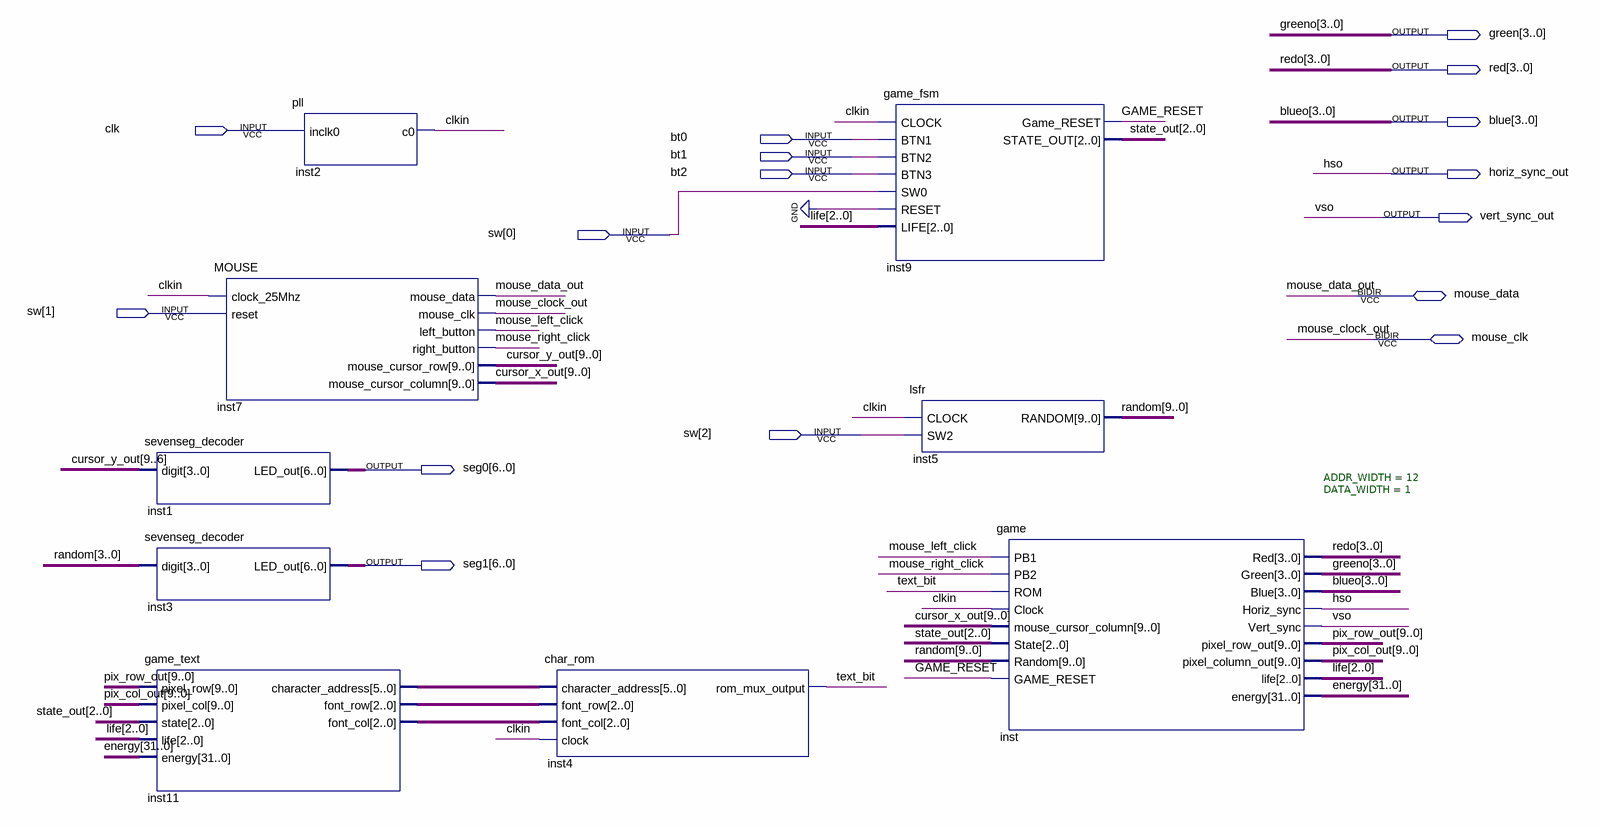
[diagram p0: schematic sheet]
// Quartus schematic miniproject.bdf as structural Verilog: 9 symbols, 16 pins
module miniproject (
  input  clk,
  input  bt0,
  input  bt1,
  input  bt2,
  input  [2:0] sw,
  inout  mouse_data,
  inout  mouse_clk,
  output [3:0] green,
  output [3:0] red,
  output [3:0] blue,
  output horiz_sync_out,
  output vert_sync_out,
  output [6:0] seg0,
  output [6:0] seg1
);

  wire clkin, GAME_RESET, mouse_left_click, mouse_right_click, text_bit;
  wire [2:0] inst11_font_col, inst11_font_row, life, state_out;
  wire [5:0] inst11_character_address;
  wire [9:0] cursor_x_out, cursor_y_out, pix_col_out, pix_row_out, random;
  wire [31:0] energy;

  sevenseg_decoder inst1 (.digit(cursor_y_out[9:6]), .LED_out(seg0));
  sevenseg_decoder inst3 (.digit(random[3:0]), .LED_out(seg1));
  game_text inst11 (
    .pixel_row(pix_row_out), .pixel_col(pix_col_out), .state(state_out), .life(life), .energy(energy),
    .character_address(inst11_character_address), .font_row(inst11_font_row), .font_col(inst11_font_col));
  MOUSE inst7 (
    .clock_25Mhz(clkin), .reset(sw[1]), .left_button(mouse_left_click), .right_button(mouse_right_click),
    .mouse_cursor_row(cursor_y_out), .mouse_cursor_column(cursor_x_out), .mouse_data(mouse_data),
    .mouse_clk(mouse_clk));
  pll inst2 (.inclk0(clk), .c0(clkin));
  char_rom inst4 (
    .character_address(inst11_character_address), .font_row(inst11_font_row), .font_col(inst11_font_col),
    .clock(clkin), .rom_mux_output(text_bit));
  game_fsm inst9 (
    .CLOCK(clkin), .BTN1(bt0), .BTN2(bt1), .BTN3(bt2), .SW0(sw[0]), .RESET(1'b0), .LIFE(life),
    .Game_RESET(GAME_RESET), .STATE_OUT(state_out));
  lsfr inst5 (.CLOCK(clkin), .SW2(sw[2]), .RANDOM(random));
  game #(.ADDR_WIDTH(12), .DATA_WIDTH(1)) inst (
    .PB1(mouse_left_click), .PB2(mouse_right_click), .ROM(text_bit), .Clock(clkin),
    .mouse_cursor_column(cursor_x_out), .State(state_out), .Random(random), .GAME_RESET(GAME_RESET),
    .Red(red), .Green(green), .Blue(blue), .Horiz_sync(horiz_sync_out), .Vert_sync(vert_sync_out),
    .pixel_row_out(pix_row_out), .pixel_column_out(pix_col_out), .life(life), .energy(energy));

  // Other names for the same wires on the sheet: blueo[3:0] = blue; greeno[3:0] = green; hso = horiz_sync_out;
  //   mouse_clock_out = mouse_clk; mouse_data_out = mouse_data; redo[3:0] = red; vso = vert_sync_out
endmodule
